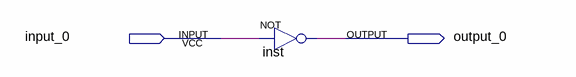
[diagram p0: schematic sheet]
// Quartus schematic Inversor.bdf as structural Verilog: 1 symbols, 2 pins
module Inversor (
  input  input_0,
  output output_0
);

  not inst (output_0, input_0);
endmodule
